# EAGLE schematic jt-100 (EAGLE 6.3)
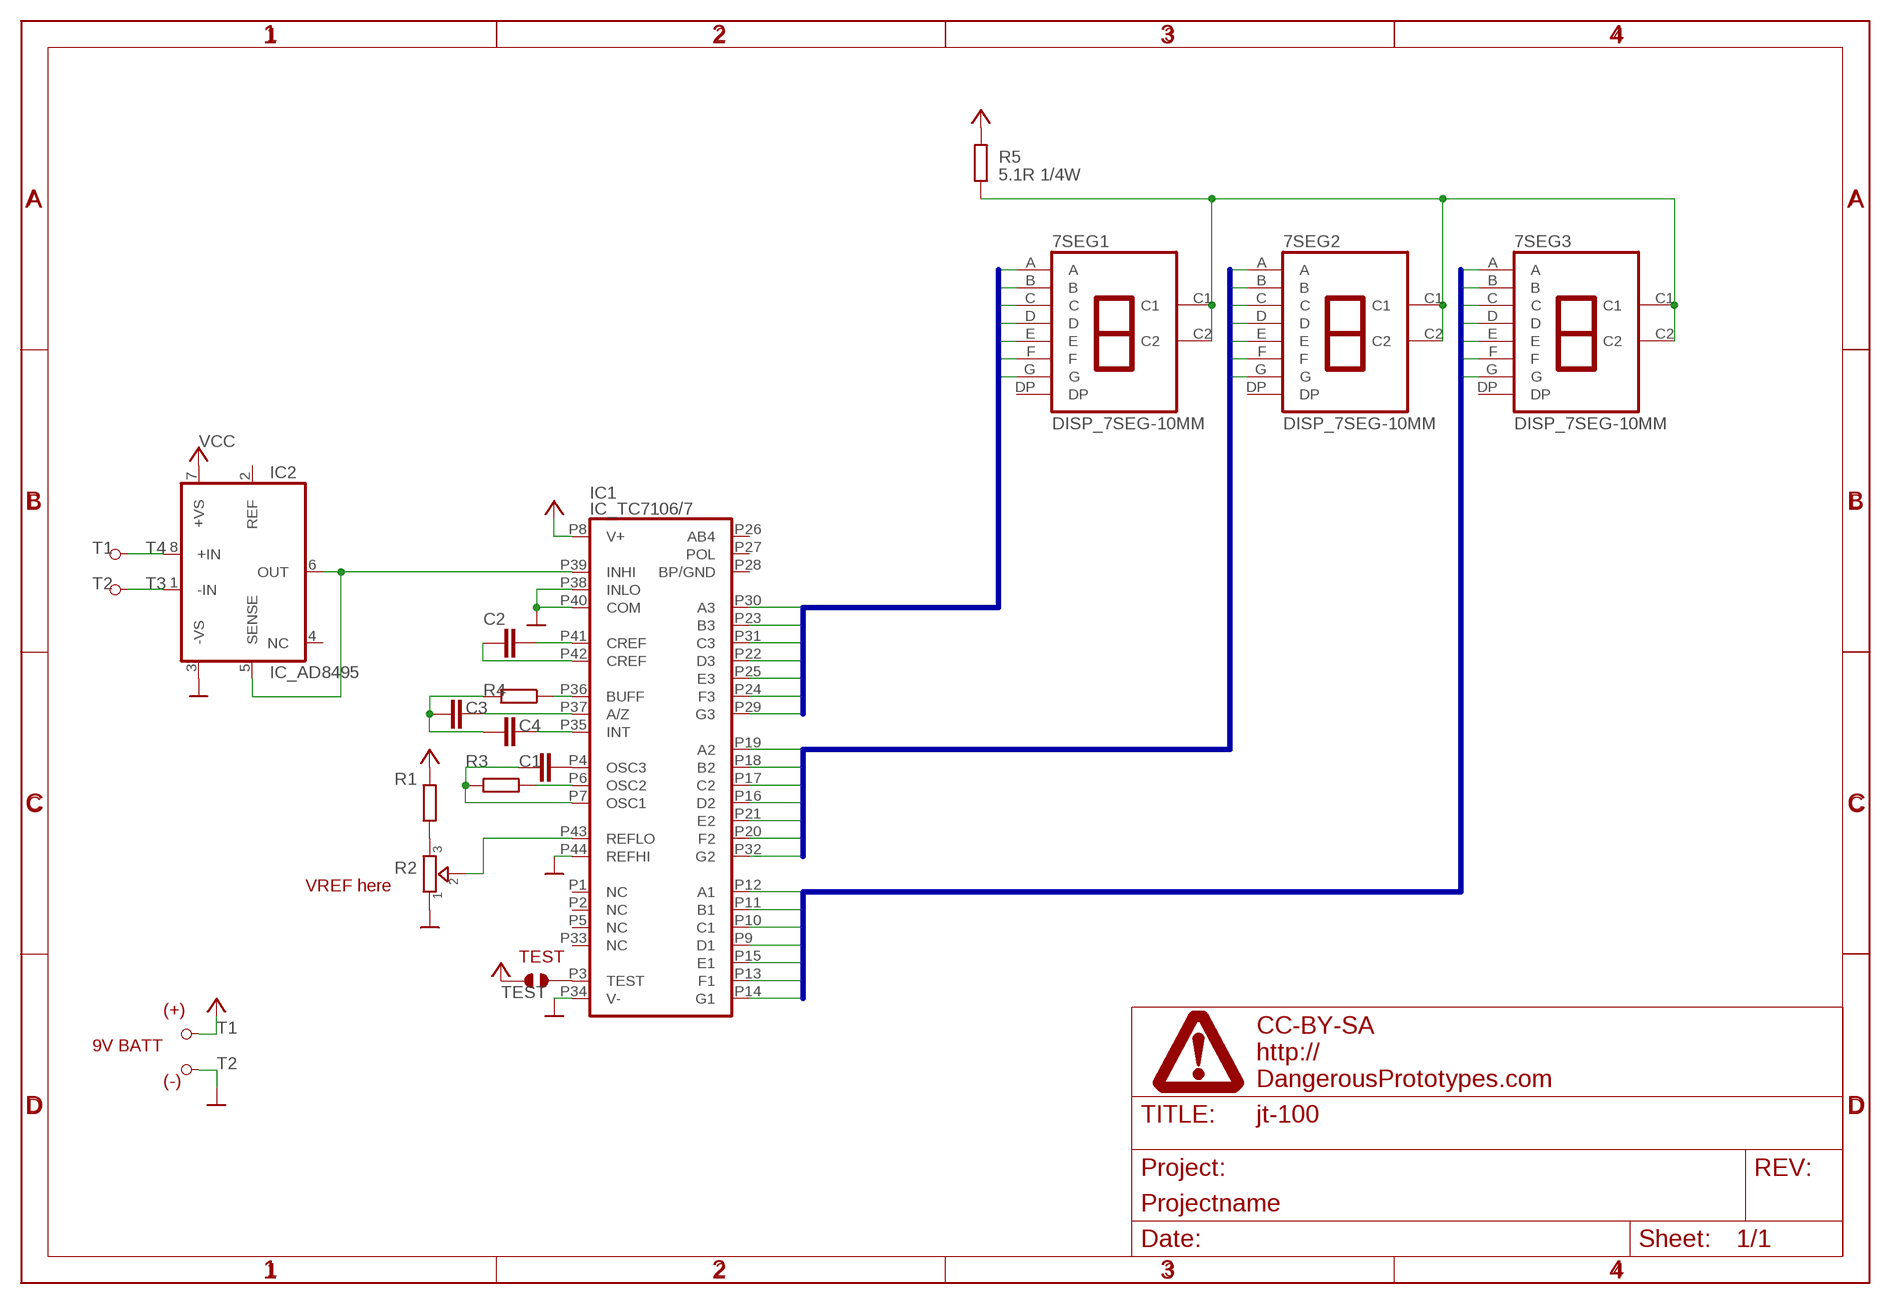
[diagram p0: schematic, sheet 1]

## Parts
7SEG1  DISP_7SEG-10MM  [DISP_7SEG_KTS_4817CKR-P]
7SEG2  DISP_7SEG-10MM  [DISP_7SEG_KTS_4817CKR-P]
7SEG3  DISP_7SEG-10MM  [DISP_7SEG_KTS_4817CKR-P]
C1  CAPACITOR_NPOL-1206  [C1206]
C2  CAPACITOR_NPOL-1206  [C1206]
C3  CAPACITOR_NPOL-1206  [C1206]
C4  CAPACITOR_NPOL-1206  [C1206]
IC1  IC_TC7106/7  [TQFP-44]
IC2  IC_AD8495  [MSOP8]
R1  RESISTOR-1206  [R1206]
R2  TRIMMER-3314G  [TRIMMER_3314G]
R3  RESISTOR-1206  [R1206]
R4  RESISTOR-1206  [R1206]
R5  5.1R 1/4W  RESISTOR-1206  [R1206]
T1  PAD_TERMINAL-1.02MM_SQUARE  [CON_PAD_SQUARE_1.02MM]
T2  PAD_TERMINAL-1.02MM_ROUND  [CON_PAD_ROUND_1.02MM]
T3  PAD_TERMINAL-1.02MM_ROUND  [CON_PAD_ROUND_1.02MM]
T4  PAD_TERMINAL-1.02MM_ROUND  [CON_PAD_ROUND_1.02MM]
TEST  JUMPER_SOLDER_1X2  [JUMPER_SOLDER_1X2]
U$1  FRAME_DINA4_L  [DP_LOGO]

## Nets
1S1: 7SEG3.A IC1.P12(A1)
1S2: 7SEG3.B IC1.P11(B1)
1S3: 7SEG3.C IC1.P10(C1)
1S4: 7SEG3.D IC1.P9(D1)
1S5: 7SEG3.E IC1.P15(E1)
1S6: 7SEG3.F IC1.P13(F1)
1S7: 7SEG3.G IC1.P14(G1)
10S1: 7SEG2.A IC1.P19(A2)
10S2: 7SEG2.B IC1.P18(B2)
10S3: 7SEG2.C IC1.P17(C2)
10S4: 7SEG2.D IC1.P16(D2)
10S5: 7SEG2.E IC1.P21(E2)
10S6: 7SEG2.F IC1.P20(F2)
10S7: 7SEG2.G IC1.P32(G2)
100S1: 7SEG1.A IC1.P30(A3)
100S2: 7SEG1.B IC1.P23(B3)
100S3: 7SEG1.C IC1.P31(C3)
100S4: 7SEG1.D IC1.P22(D3)
100S5: 7SEG1.E IC1.P25(E3)
100S6: 7SEG1.F IC1.P24(F3)
100S7: 7SEG1.G IC1.P29(G3)
GND: IC1.P34(V-) IC1.P38(INLO) IC1.P40(COM) IC1.P44(REFHI) IC2.3(-VS) R2.1 T2.P ; supply symbol labelled SUPPLY_GND
N$1: IC1.P39(INHI) IC2.5(SENSE) IC2.6(OUT)
N$2: R1.1 R2.3
N$3: IC1.P43(REFLO) R2.2
N$4: C1.2 IC1.P4(OSC3)
N$5: C1.1 IC1.P7(OSC1) R3.2
N$6: IC1.P6(OSC2) R3.1
N$7: C2.2 IC1.P41(CREF)
N$8: C2.1 IC1.P42(CREF)
N$9: IC1.P36(BUFF) R4.1
N$10: C3.1 C4.1 R4.2
N$11: C3.2 IC1.P37(A/Z)
N$12: C4.2 IC1.P35(INT)
N$13: 7SEG1.C1 7SEG1.C2 7SEG2.C1 7SEG2.C2 7SEG3.C1 7SEG3.C2 R5.1
N$14: IC1.P3(TEST) TEST.2
T1: IC2.8(+IN) T4.P
T2: IC2.1(-IN) T3.P
VCC: IC1.P8(V+) IC2.7(+VS) R1.2 R5.2 T1.P TEST.1
Unconnected: 7SEG1.DP 7SEG2.DP 7SEG3.DP IC1.P1(NC) IC1.P2(NC) IC1.P5(NC) IC1.P26(AB4) IC1.P27(POL) IC1.P28(BP/GND) IC1.P33(NC) IC2.2(REF) IC2.4(NC)

## Buses
1S[1..7]
10S[1..7]
100S[1..7]

## Notes on the sheet
- VREF here
- TEST
- (+)
- 9V BATT
- (-)

## Library data of the parts
7SEG1-7SEG3 = dp_devices.v6:DISP_7SEG
C1-C4 = dp_devices.v6:CAPACITOR_NPOL: Non-Polarized capacitor in various packages
IC1 = dp_devices.v6:IC_TC7106/7: 3-1/2 Digit analog to digital converter http://www.mouser.com/ds/2/268/21455b-3248.pdf
IC2 = dp_devices.v6:IC_AD8495
R1 R3-R5 = dp_devices.v6:RESISTOR
R2 = dp_devices.v6:TRIMMER: Trimmer resistor
T1-T4 = dp_devices.v6:PAD_TERMINAL: Terminal connection pad
TEST = dp_devices.v6:JUMPER_SOLDER_1X2
U$1 = dp_devices.v6:FRAME_DINA4_L: A4 DP frame Standard Dangerous Prototypes schematic frame. Automagically adds the DP logo and standard texts to the PCB Use the atrribute in the schematic editor to change the fields.; FF1: fulfillment by; FF2: Seeed Studio; FF3: www.seeedstudio.com; LICENSE: CC-BY-SA; PROJECT: Projectname; URL1: http://; URL2: DangerousPrototypes.com